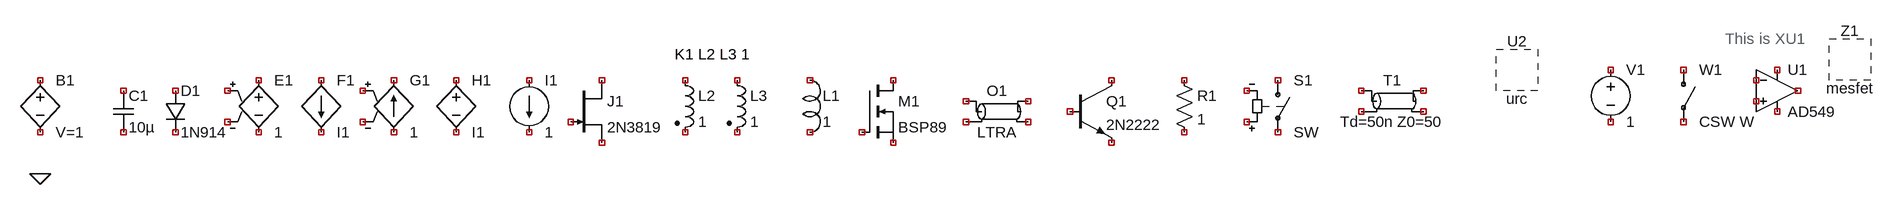
[diagram p0: schematic all_elements_lt.asc]
all_elements_lt.asc, the LTspice schematic file:
Version 4.1
SHEET 1 1584 680
FLAG -1424 -384 0
SYMBOL bv -1424 -544 R0
SYMATTR InstName B1
SYMATTR Value V=1
SYMBOL cap -1312 -512 R0
SYMATTR InstName C1
SYMATTR Value 10µ
SYMBOL diode -1232 -512 R0
SYMATTR InstName D1
SYMATTR Value 1N914
SYMBOL e -1088 -544 R0
SYMATTR InstName E1
SYMATTR Value 1
SYMBOL f -992 -528 R0
SYMATTR InstName F1
SYMATTR Value I1
SYMBOL g -880 -544 R0
SYMATTR InstName G1
SYMATTR Value 1
SYMBOL h -784 -544 R0
SYMATTR InstName H1
SYMATTR Value I1
SYMBOL current -672 -528 R0
WINDOW 123 0 0 Left 0
WINDOW 39 0 0 Left 0
SYMATTR InstName I1
SYMATTR Value 1
SYMBOL njf -608 -528 R0
SYMATTR InstName J1
SYMATTR Value 2N3819
SYMBOL ind2 -448 -544 R0
SYMATTR InstName L2
SYMATTR Value 1
SYMBOL ind2 -368 -544 R0
SYMATTR InstName L3
SYMATTR Value 1
SYMBOL ind -256 -544 R0
SYMATTR InstName L1
SYMATTR Value 1
SYMBOL nmos -160 -528 R0
SYMATTR InstName M1
SYMATTR Value BSP89
SYMBOL ltline 48 -480 R0
SYMATTR InstName O1
SYMBOL npn 160 -528 R0
SYMATTR InstName Q1
SYMATTR Value 2N2222
SYMBOL res 320 -544 R0
SYMATTR InstName R1
SYMATTR Value 1
SYMBOL sw 480 -544 R0
SYMATTR InstName S1
SYMBOL tline 656 -496 R0
SYMATTR InstName T1
SYMBOL Misc\\urc 848 -544 R0
SYMATTR InstName U2
SYMBOL voltage 992 -560 R0
WINDOW 123 0 0 Left 0
WINDOW 39 0 0 Left 0
SYMATTR InstName V1
SYMATTR Value 1
SYMBOL csw 1104 -544 R0
SYMATTR InstName W1
SYMATTR Value CSW W
SYMBOL OpAmps\\AD549 1248 -576 R0
SYMATTR InstName U1
SYMBOL mesfet 1360 -560 R0
SYMATTR InstName Z1
TEXT -448 -568 Left 2 !K1 L2 L3 1
TEXT 1168 -592 Left 2 ;This is XU1

The netlist it stands for:
* all_elements_lt.asc
B1 NC_01 NC_02 V=1
C1 NC_03 NC_04 10µ
D1 NC_05 NC_06 1N914
E1 NC_07 NC_08 NC_09 NC_10 1
F1 NC_11 NC_12 I1
G1 NC_13 NC_14 NC_15 NC_16 1
H1 NC_17 NC_18 I1
I1 NC_19 NC_20 1
J1 NC_21 NC_22 NC_23 2N3819
L2 NC_24 NC_25 1
L3 NC_26 NC_27 1
L1 NC_28 NC_29 1
M1 NC_30 NC_31 NC_32 NC_32 BSP89
O1 NC_33 NC_34 NC_35 NC_36 LTRA
Q1 NC_37 NC_38 NC_39 0 2N2222
R1 NC_40 NC_41 1
S1 NC_42 NC_43 NC_44 NC_45 SW
T1 NC_46 NC_47 NC_48 NC_49 Td=50n Z0=50
* U2: urc (symbol Misc\urc not available, pin order unknown); nets seen at it: 
V1 NC_50 NC_51 1
W1 NC_52 NC_53 CSW W
X§U1 NC_54 NC_55 NC_56 NC_57 NC_58 AD549  ; pins In+ In- V+ V- OUT
* Z1: mesfet (symbol mesfet not available, pin order unknown); nets seen at it: 
.model D D
.lib standard.dio
.model NPN NPN
.model PNP PNP
.lib standard.bjt
.model NJF NJF
.model PJF PJF
.lib standard.jft
.model NMOS NMOS
.model PMOS PMOS
.lib standard.mos
K1 L2 L3 1
* This is XU1
.backanno
.end